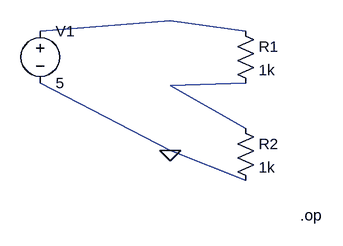
[diagram p0: schematic divider.asc]
divider.asc, the LTspice schematic file:
Version 4
SHEET 1 880 680
WIRE 0 16 200 0
WIRE 0 96 200 200
WIRE 316 16 200 0
WIRE 316 96 200 100
WIRE 316 166 200 100
WIRE 316 246 200 200
FLAG 200 200 0
SYMBOL voltage 0 0 R0
SYMATTR InstName V1
SYMATTR Value 5
SYMBOL res 300 0 R0
SYMATTR InstName R1
SYMATTR Value 1k
SYMBOL res 300 150 R0
SYMATTR InstName R2
SYMATTR Value 1k
TEXT 400 300 Left 2 !.op

The netlist it stands for:
* divider.asc
V1 N001 0 5
R1 N001 N002 1k
R2 N002 0 1k
.op
.backanno
.end